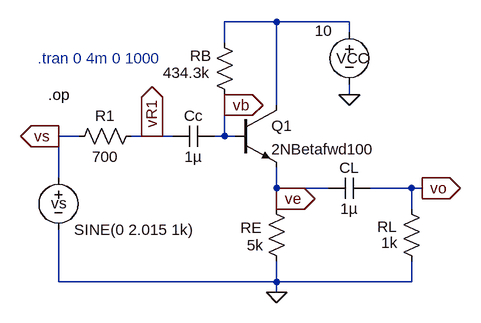
[diagram p0: schematic prob6_50D_schematic.asc]
prob6_50D_schematic.asc, the LTspice schematic file:
Version 4
SHEET 1 880 680
WIRE 336 -80 256 -80
WIRE 448 -80 336 -80
WIRE 448 -64 448 -80
WIRE 256 -48 256 -80
WIRE 448 32 448 16
WIRE 256 48 256 32
WIRE 336 48 336 -80
WIRE 32 96 0 96
WIRE 144 96 112 96
WIRE 176 96 144 96
WIRE 256 96 256 48
WIRE 256 96 240 96
WIRE 272 96 256 96
WIRE 0 160 0 96
WIRE 336 176 336 144
WIRE 416 176 336 176
WIRE 544 176 480 176
WIRE 560 176 544 176
WIRE 336 192 336 176
WIRE 336 208 336 192
WIRE 544 208 544 176
WIRE 0 320 0 240
WIRE 336 320 336 288
WIRE 336 320 0 320
WIRE 544 320 544 288
WIRE 544 320 336 320
WIRE 336 336 336 320
FLAG 448 32 0
FLAG 336 336 0
FLAG 560 176 vo
IOPIN 560 176 Out
FLAG 336 192 ve
IOPIN 336 192 Out
FLAG 256 48 vb
IOPIN 256 48 Out
FLAG 0 96 vs
IOPIN 0 96 Out
FLAG 144 96 vR1
IOPIN 144 96 Out
SYMBOL voltage 0 144 R0
WINDOW 0 -11 55 Left 2
WINDOW 123 0 0 Left 0
WINDOW 39 0 0 Left 0
SYMATTR InstName vs
SYMATTR Value SINE(0 2.015 1k)
SYMBOL res 128 80 R90
WINDOW 0 0 56 VBottom 2
WINDOW 3 32 56 VTop 2
SYMATTR InstName R1
SYMATTR Value 700
SYMBOL res 272 48 R180
WINDOW 0 36 76 Left 2
WINDOW 3 38 50 Left 2
SYMATTR InstName RB
SYMATTR Value 434.3k
SYMBOL res 352 304 R180
WINDOW 0 39 67 Left 2
WINDOW 3 36 40 Left 2
SYMATTR InstName RE
SYMATTR Value 5k
SYMBOL npn 272 48 R0
SYMATTR InstName Q1
SYMATTR Value 2NBetafwd100
SYMBOL res 560 304 R180
WINDOW 0 38 69 Left 2
WINDOW 3 37 44 Left 2
SYMATTR InstName RL
SYMATTR Value 1k
SYMBOL cap 240 80 R90
WINDOW 0 0 32 VBottom 2
WINDOW 3 32 32 VTop 2
SYMATTR InstName Cc
SYMATTR Value 1µ
SYMBOL cap 480 160 R90
WINDOW 0 0 32 VBottom 2
WINDOW 3 32 32 VTop 2
SYMATTR InstName CL
SYMATTR Value 1µ
SYMBOL voltage 448 -80 R0
WINDOW 0 -20 56 Left 2
WINDOW 3 -53 14 Left 2
SYMATTR InstName VCC
SYMATTR Value 10
TEXT -32 -24 Left 2 ;.tran 0 4m 0 1000
TEXT -16 32 Left 2 !.op

The netlist it stands for:
* prob6_50D_schematic.asc
vs vs 0 SINE(0 2.015 1k)
R1 vR1 vs 700
RB vb N001 434.3k
RE 0 ve 5k
Q1 N001 vb ve 0 2NBetafwd100
RL 0 vo 1k
Cc vb vR1 1µ
CL vo ve 1µ
VCC N001 0 10
.model NPN NPN
.model PNP PNP
.lib standard.bjt
* .tran 0 4m 0 1000
.op
.backanno
.end